# Altium project ESP12_RGBW_00.PrjPcb
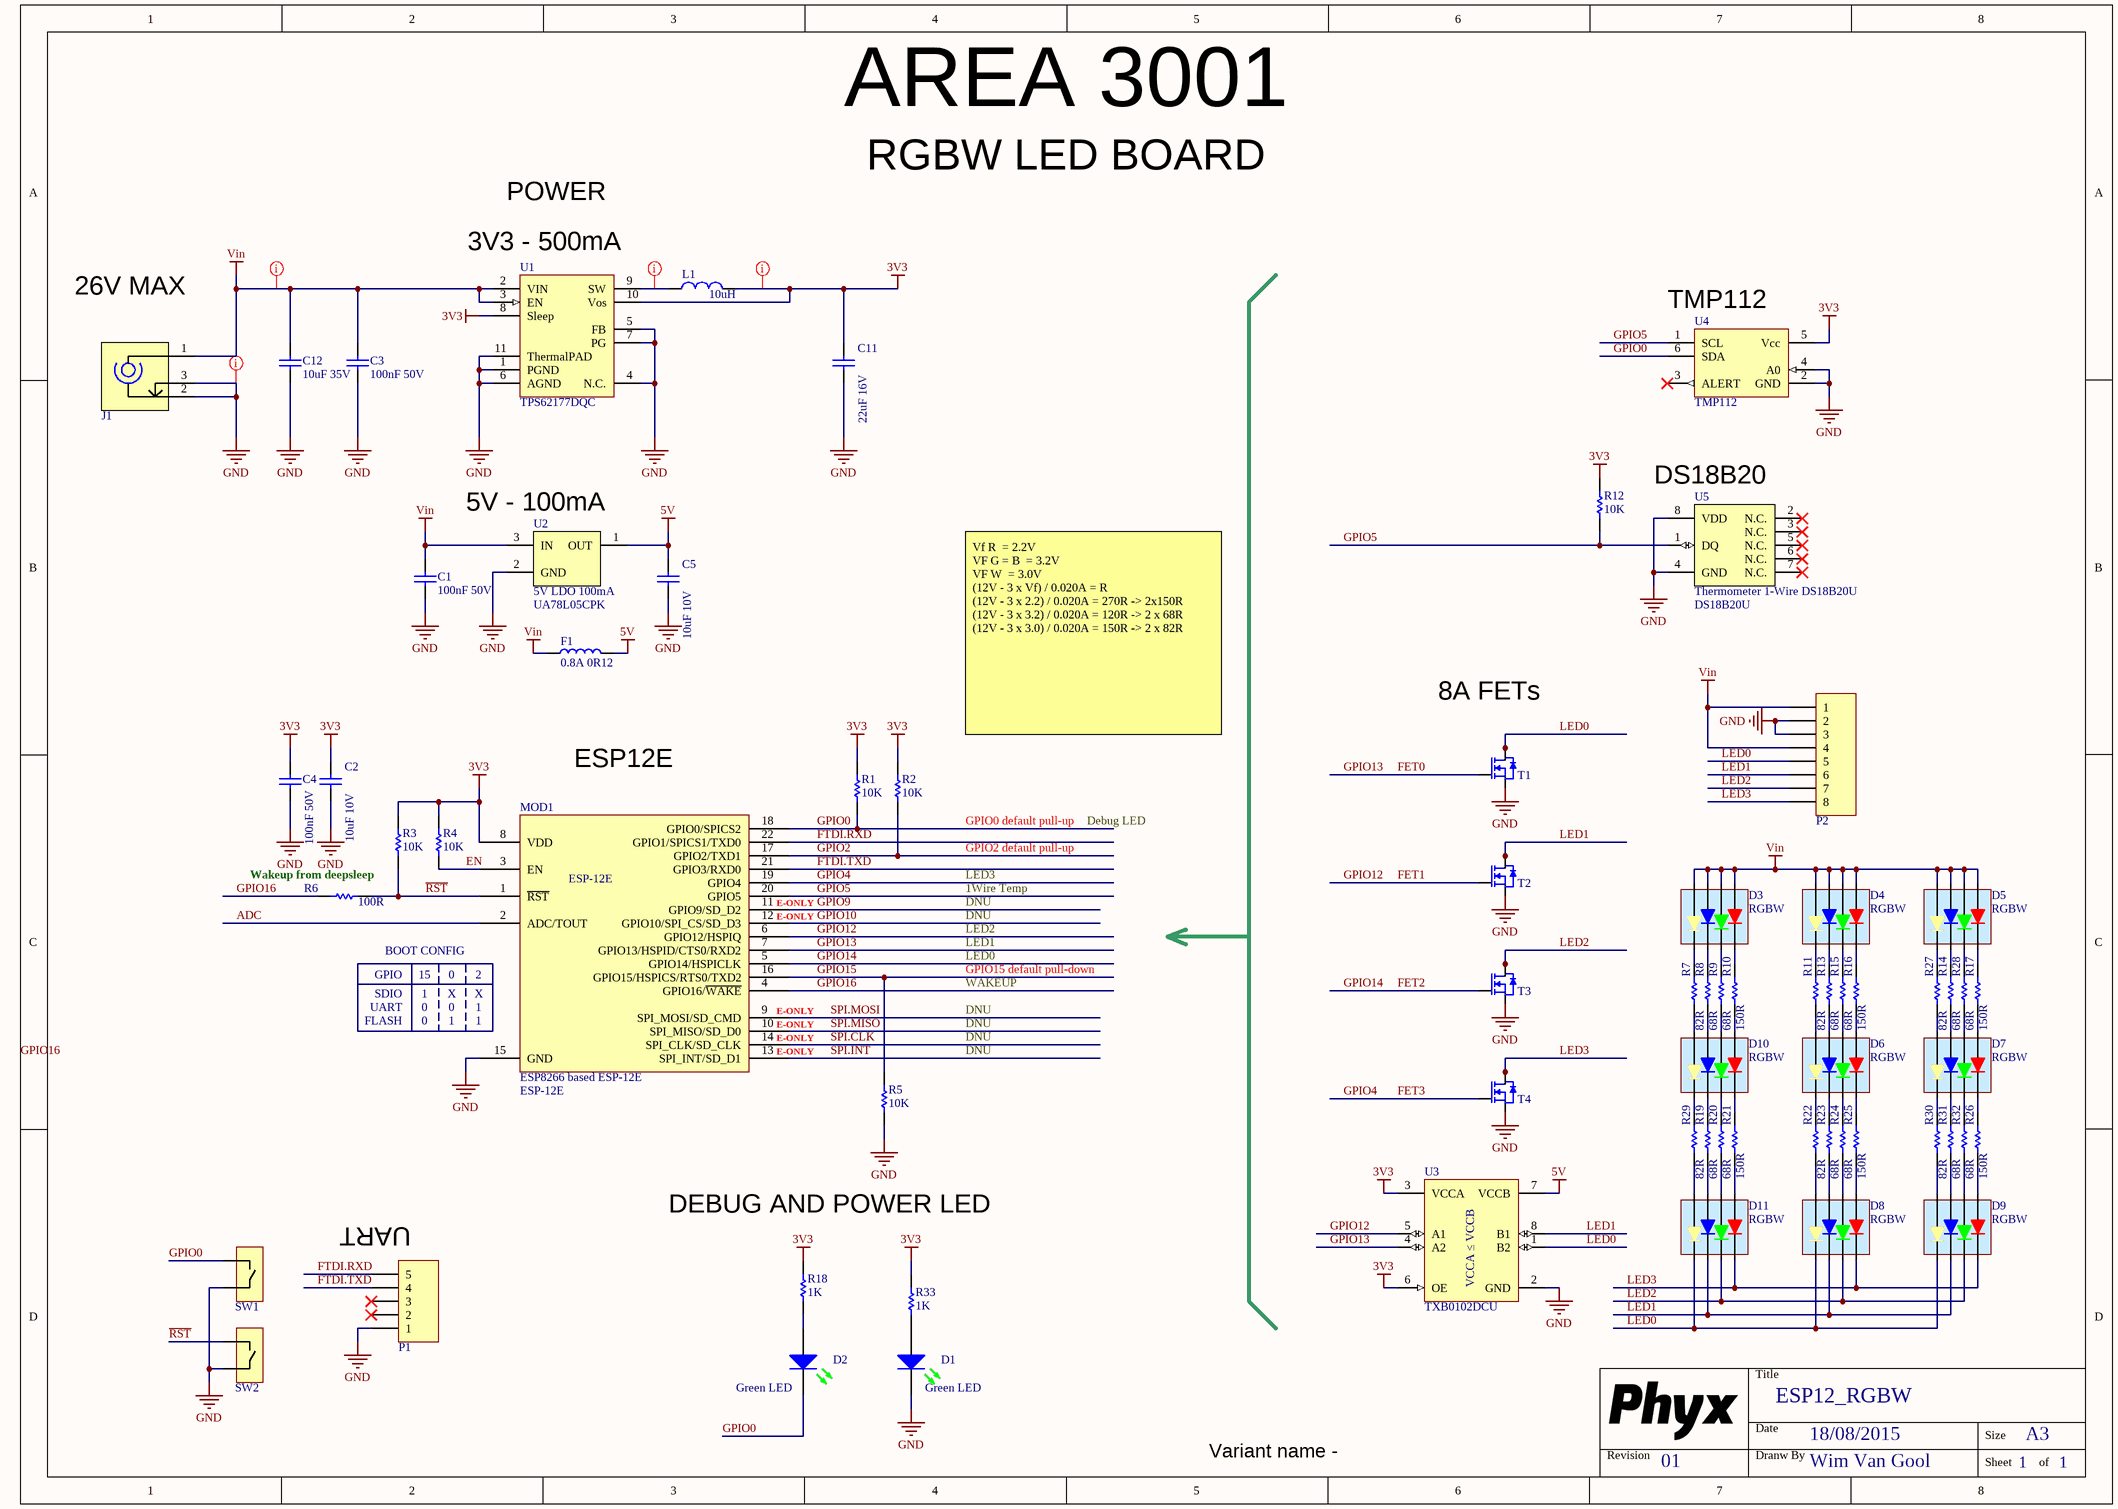
[diagram p0: ESP12_RGBW_00.SchDoc]
PCB_ENGINEER: WimVG; PCB_REV: 00; PCB_TITLE: ESP12_RGBW
1 sheet, 68 parts. Net scope: global (net labels, ports and power ports of the same name join across sheets).
Board file: ESP12_RGBW_00.PcbDoc

## Sheet ESP12_RGBW_00.SchDoc: ESP12_RGBW
size A3; Date: 18/08/2015; DrawnBy: Wim Van Gool; Revision: 01; SheetNumber: 1; SheetTotal: 1; PageSetup: Record=PageOptions|CenterHorizontal=True|CenterVertical=True|PrintScale=0.70|XCorrection=1.00|YCorrection=1.00|PrintKind=1|BorderSize=5000000|LeftOffset=0|BottomOffset=0|Orientation=2|PaperLength=1000|PaperWidth=1000|Scale=100|PaperSource=15|PrintQuality=600|MediaType=1|DitherType=10|PrintScaleMode=1|PaperKind=A4 (210 x 297 mm)|PaperIndex=9

### Parts
C1  value 100nF 50V  [C0603_N]  (hidden comment: CAP_CERAMIC)
C2  value 10uF 10V  [C1206_N]  (hidden comment: CAP_CERAMIC)
C3  value 100nF 50V  [C0603_N]  (hidden comment: CAP_CERAMIC)
C4  value 100nF 50V  [C0603_N]  (hidden comment: CAP_CERAMIC)
C5  value 10uF 10V  [C1206_N]  (hidden comment: CAP_CERAMIC)
C11  value 22uF 16V  [C1206_N]  (hidden comment: CAP_CERAMIC)
C12  value 10uF 35V  [C1206_N]  (hidden comment: CAP_CERAMIC)
D1  Green LED  [LED_0805_GR]
D2  Green LED  [LED_0805_GR]
D3  value RGBW  [LED_5050_RGBW_PLCC8]  (hidden comment: 5050 RGBW LED)
D4  value RGBW  [LED_5050_RGBW_PLCC8]  (hidden comment: 5050 RGBW LED)
D5  value RGBW  [LED_5050_RGBW_PLCC8]  (hidden comment: 5050 RGBW LED)
D6  value RGBW  [LED_5050_RGBW_PLCC8]  (hidden comment: 5050 RGBW LED)
D7  value RGBW  [LED_5050_RGBW_PLCC8]  (hidden comment: 5050 RGBW LED)
D8  value RGBW  [LED_5050_RGBW_PLCC8]  (hidden comment: 5050 RGBW LED)
D9  value RGBW  [LED_5050_RGBW_PLCC8]  (hidden comment: 5050 RGBW LED)
D10  value RGBW  [LED_5050_RGBW_PLCC8]  (hidden comment: 5050 RGBW LED)
D11  value RGBW  [LED_5050_RGBW_PLCC8]  (hidden comment: 5050 RGBW LED)
F1  value 0.8A 0R12  [L0805]  (hidden comment: FERRITE)
J1  Socket RA 4.75 with 1.75 barrel  [694105309102]  (value not drawn)
L1  value 10uH  [BRNS_SDR0503]  (hidden comment: SDR0503-100ML)
MOD1  ESP8266 based ESP-12E  value ESP-12E  [ESP-12E]
P1  Header 5  [HDR1X5]  (value not drawn)
P2  8 Terminal Socket RA 3,5mm  [WE_691322110008]  (value not drawn)
R1  value 10K  [R0603_N]  (hidden comment: RESISTOR)
R2  value 10K  [R0603_N]  (hidden comment: RESISTOR)
R3  value 10K  [R0603_N]  (hidden comment: RESISTOR)
R4  value 10K  [R0603_N]  (hidden comment: RESISTOR)
R5  value 10K  [R0603_N]  (hidden comment: RESISTOR)
R6  value 100R  [R0603_N]  (hidden comment: RESISTOR)
R7  value 82R  [R0603_N]  (hidden comment: RESISTOR)
R8  value 68R  [R0603_N]  (hidden comment: RESISTOR)
R9  value 68R  [R0603_N]  (hidden comment: RESISTOR)
R10  value 150R  [R0603_N]  (hidden comment: RESISTOR)
R11  value 82R  [R0603_N]  (hidden comment: RESISTOR)
R12  value 10K  [R0603_N]  (hidden comment: RESISTOR)
R13  value 68R  [R0603_N]  (hidden comment: RESISTOR)
R14  value 68R  [R0603_N]  (hidden comment: RESISTOR)
R15  value 68R  [R0603_N]  (hidden comment: RESISTOR)
R16  value 150R  [R0603_N]  (hidden comment: RESISTOR)
R17  value 150R  [R0603_N]  (hidden comment: RESISTOR)
R18  value 1K  [R0603_N]  (hidden comment: RESISTOR)
R19  value 68R  [R0603_N]  (hidden comment: RESISTOR)
R20  value 68R  [R0603_N]  (hidden comment: RESISTOR)
R21  value 150R  [R0603_N]  (hidden comment: RESISTOR)
R22  value 82R  [R0603_N]  (hidden comment: RESISTOR)
R23  value 68R  [R0603_N]  (hidden comment: RESISTOR)
R24  value 68R  [R0603_N]  (hidden comment: RESISTOR)
R25  value 150R  [R0603_N]  (hidden comment: RESISTOR)
R26  value 150R  [R0603_N]  (hidden comment: RESISTOR)
R27  value 82R  [R0603_N]  (hidden comment: RESISTOR)
R28  value 68R  [R0603_N]  (hidden comment: RESISTOR)
R29  value 82R  [R0603_N]  (hidden comment: RESISTOR)
R30  value 82R  [R0603_N]  (hidden comment: RESISTOR)
R31  value 68R  [R0603_N]  (hidden comment: RESISTOR)
R32  value 68R  [R0603_N]  (hidden comment: RESISTOR)
R33  value 1K  [R0603_N]  (hidden comment: RESISTOR)
SW1  LP SMD tact sw WS-TASV  [WE_434153017835]  (value not drawn)
SW2  LP SMD tact sw WS-TASV  [WE_434153017835]  (value not drawn)
T1  8A N-Ch MOSFET Vgs 1.9  [SOT23-6]  (value not drawn)
T2  8A N-Ch MOSFET Vgs 1.9  [SOT23-6]  (value not drawn)
T3  8A N-Ch MOSFET Vgs 1.9  [SOT23-6]  (value not drawn)
T4  8A N-Ch MOSFET Vgs 1.9  [SOT23-6]  (value not drawn)
U1  value TPS62177DQC  [TI_DQC_WSON10]  (hidden comment: Fixed 3.3V Buck 0.5A)
U2  5V LDO 100mA  value UA78L05CPK  [TI_PK]
U3  value TXB0102DCU  [TI_DCU_R-PDSO-G8]  (hidden comment: 2-bit Bi Level translator, 15kV ESD)
U4  value TMP112  [TI_DRL_R-PDSO-N6]  (hidden comment: I2C Temp sensor High Accuracy)
U5  Thermometer 1-Wire DS18B20U  value DS18B20U  [MAX_uSOP8]

### Nets
3V3: C2.1 C4.1 C11.1 L1.2 MOD1.8(VDD) R1.1 R2.1 R3.1 R4.1 R12.1 R18.1 R33.1 U1.8(Sleep) U1.10(Vos) U3.3(VCCA) U3.6(OE) U4.5(Vcc)
5V: C5.1 F1.2 U2.1(OUT) U3.7(VCCB)
GND: C1.2 C2.2 C3.2 C4.2 C5.2 C11.2 C12.2 D1.2(K) J1.2 J1.3 MOD1.15(GND) P1.1 P2.2 P2.3 R5.2 SW1.2 SW2.2 T1.4(S) T2.4(S) T3.4(S) T4.4(S) U1.1(PGND) U1.4(N.C.) U1.5(FB) U1.6(AGND) U1.7(PG) U1.11(ThermalPAD) U2.2(GND) U3.2(GND) U4.2(GND) U4.4(A0) U5.4(GND) U5.8(VDD)
Vin: C1.1 C3.1 C12.1 D3.1(RA) D3.3(GA) D3.5(BA) D3.7(WA) D4.1(RA) D4.3(GA) D4.5(BA) D4.7(WA) D5.1(RA) D5.3(GA) D5.5(BA) D5.7(WA) F1.1 J1.1 P2.1 P2.4 U1.2(VIN) U1.3(EN) U2.3(IN)
ADC: MOD1.2(ADC/TOUT)
EN: MOD1.3(EN) R4.2
FET0: MOD1.7(GPIO13/HSPID/CTS0/RXD2) T1.3(G) U3.4(A2)  [also labelled GPIO13]
FET1: MOD1.6(GPIO12/HSPIQ) T2.3(G) U3.5(A1)  [also labelled GPIO12]
FET2: MOD1.5(GPIO14/HSPICLK) T3.3(G)  [also labelled GPIO14]
FET3: MOD1.19(GPIO4) T4.3(G)  [also labelled GPIO4]
FTDI.RXD: MOD1.22(GPIO1/SPICS1/TXD0) P1.5
FTDI.TXD: MOD1.21(GPIO3/RXD0) P1.4
GPIO0: D2.2(K) MOD1.18(GPIO0/SPICS2) R1.2 SW1.1 U4.6(SDA)
GPIO2: MOD1.17(GPIO2/TXD1) R2.2
GPIO5: MOD1.20(GPIO5) R12.2 U4.1(SCL) U5.1(DQ)
GPIO9: MOD1.11(GPIO9/SD_D2)
GPIO10: MOD1.12(GPIO10/SPI_CS/SD_D3)
GPIO15: MOD1.16(GPIO15/HSPICS/RTS0/TXD2) R5.1
GPIO16: MOD1.4(GPIO16/~{WAKE}) R6.2
LED0: D8.8(WC) D9.8(WC) D11.8(WC) P2.5 T1.1(D) T1.2(D) T1.5(D) T1.6(D) U3.1(B2)
LED1: D8.6(BC) D9.6(BC) D11.6(BC) P2.6 T2.1(D) T2.2(D) T2.5(D) T2.6(D) U3.8(B1)
LED2: D8.4(GC) D9.4(GC) D11.4(GC) P2.7 T3.1(D) T3.2(D) T3.5(D) T3.6(D)
LED3: D8.2(RC) D9.2(RC) D11.2(RC) P2.8 T4.1(D) T4.2(D) T4.5(D) T4.6(D)
~{RST}: MOD1.1(~{RST}) R3.2 R6.1 SW2.1
SPI.CLK: MOD1.14(SPI_CLK/SD_CLK)
SPI.INT: MOD1.13(SPI_INT/SD_D1)
SPI.MISO: MOD1.10(SPI_MISO/SD_D0)
SPI.MOSI: MOD1.9(SPI_MOSI/SD_CMD)
NetD1_1: D1.1(A) R33.2
NetD2_1: D2.1(A) R18.2
NetD3_2: D3.2(RC) R10.1
NetD3_4: D3.4(GC) R9.1
NetD3_6: D3.6(BC) R8.1
NetD3_8: D3.8(WC) R7.1
NetD4_2: D4.2(RC) R16.1
NetD4_4: D4.4(GC) R15.1
NetD4_6: D4.6(BC) R13.1
NetD4_8: D4.8(WC) R11.1
NetD5_2: D5.2(RC) R17.1
NetD5_4: D5.4(GC) R28.1
NetD5_6: D5.6(BC) R14.1
NetD5_8: D5.8(WC) R27.1
NetD6_1: D6.1(RA) R16.2
NetD6_2: D6.2(RC) R25.1
NetD6_3: D6.3(GA) R15.2
NetD6_4: D6.4(GC) R24.1
NetD6_5: D6.5(BA) R13.2
NetD6_6: D6.6(BC) R23.1
NetD6_7: D6.7(WA) R11.2
NetD6_8: D6.8(WC) R22.1
NetD7_1: D7.1(RA) R17.2
NetD7_2: D7.2(RC) R26.1
NetD7_3: D7.3(GA) R28.2
NetD7_4: D7.4(GC) R32.1
NetD7_5: D7.5(BA) R14.2
NetD7_6: D7.6(BC) R31.1
NetD7_7: D7.7(WA) R27.2
NetD7_8: D7.8(WC) R30.1
NetD8_1: D8.1(RA) R25.2
NetD8_3: D8.3(GA) R24.2
NetD8_5: D8.5(BA) R23.2
NetD8_7: D8.7(WA) R22.2
NetD9_1: D9.1(RA) R26.2
NetD9_3: D9.3(GA) R32.2
NetD9_5: D9.5(BA) R31.2
NetD9_7: D9.7(WA) R30.2
NetD10_1: D10.1(RA) R10.2
NetD10_2: D10.2(RC) R21.1
NetD10_3: D10.3(GA) R9.2
NetD10_4: D10.4(GC) R20.1
NetD10_5: D10.5(BA) R8.2
NetD10_6: D10.6(BC) R19.1
NetD10_7: D10.7(WA) R7.2
NetD10_8: D10.8(WC) R29.1
NetD11_1: D11.1(RA) R21.2
NetD11_3: D11.3(GA) R20.2
NetD11_5: D11.5(BA) R19.2
NetD11_7: D11.7(WA) R29.2
NetL1_1: L1.1 U1.9(SW)

Not connected (* = marked no-connect by the designer): P1 2* 3*; U4 3(ALERT)*; U5 2(N.C.)* 3(N.C.)* 5(N.C.)* 6(N.C.)* 7(N.C.)*

### Layout directives
net class POWER: 3V3, GND, NetL1_1, Vin

### Notes on the sheet
- AREA 3001
- RGBW LED BOARD
- POWER
- 26V MAX
- (near U1) 3V3 - 500mA
- (near U4) TMP112
- (near U2) 5V - 100mA
- (near U5) DS18B20
- (near T1) 8A FETs
- ESP12E
- Vf R 	= 2.2V
  VF G = B 	= 3.2V
  VF W 	= 3.0V
  (12V - 3 x Vf) / 0.020A = R
  (12V - 3 x 2.2) / 0.020A = 270R -> 2x150R
  (12V - 3 x 3.2) / 0.020A = 120R -> 2 x 68R
  (12V - 3 x 3.0) / 0.020A = 150R -> 2 x 82R
- GPIO0 default pull-up
- GPIO2 default pull-up
- Debug LED
- (near R6) Wakeup from deepsleep
- (near MOD1) E-ONLY
- DNU
- 1Wire Temp
- LED3
- GPIO
- SDIO
- 15
- 1
- BOOT CONFIG
- 0
- X
- (near MOD1) 2
- (near MOD1) X
- GPIO15 default pull-down
- WAKEUP
- LED0
- LED1
- LED2
- UART
- FLASH
- (near MOD1) 1
- (near P1) UART
- DEBUG AND POWER LED
- Title
- Variant name -
- Revision
- Date
- Dranw By
- Size
- A3
- Sheet
- of
- Labels drawn without touching a wire or pin: GPIO16
- (in symbol LVL # 2ch TXB0102DCU) VCCA ≤ VCCB

### Library data of the parts
C1 C3 C4 = CAP # 100nF 50V 0603: Capacitor Ceramic; Supplier 1: Farnell; Supplier Part Number 1: 1759122
C2 C5 = CAP # 10uF 10V 0805: Capacitor Ceramic; Supplier 1: Farnell; Supplier Part Number 1: 2320859
C11 = CAP # 22uF 16V 1206 X5R: Capacitor Ceramic; Supplier 1: Farnell; Supplier Part Number 1: 2320923
C12 = CAP # 10uF 35V 1206 X5R: Capacitor Ceramic; Supplier 1: Farnell; Supplier Part Number 1: 1797011
D1 D2 = LED # Green 0805: =Description; Supplier 1: Farnell; Supplier Part Number 1: 2099239
D3-D11 = LED # RGBW 5050: =Description; Supplier 1: Aliexpress
F1 = FER # 120R 0.8A 0805 0R12: Supplier 1: Farnell; Supplier Part Number 1: 1669728
J1 = SCKT 1.75mm barrel in board - 694105309102: Socket RA 5.5  with 2.1 barrel; Value: 694105309102; Supplier 1: Farnell
L1 = IND # 10uH 5x4.8mm SDR0503-100ML: Supplier 1: Farnell; Supplier Part Number 1: 1612675
MOD1 = WiFi # MOD ESP-12E: =Description
P1 = Pin Header 2.54mm 5way: Description: Pin Header 2.54mm 5way
P2 = Terminal Block Socket RA 3,5mm 8way - 691322110008: Value: 691322110008
R1-R5 R12 = RES # 10K 0603
R6 = RES # 100R 0603
R7 R11 R22 R27 R29 R30 = RES # 82R 0603: Description: RES # 82R 0603
R8 R9 R13-R15 R19 R20 R23 R24 R28 R31 R32 = RES # 68R 0603
R10 R16 R17 R21 R25 R26 = RES # 150R 0603: Description: RES # 150R 0603
R18 R33 = RES # 1K 0603
SW1 SW2 = SW # TACT mini 3.5x2.9 mm SMD J-Bend WS-TASV: Value: 434153017835; Description: SW # TACT mini 3.5x2.9 mm SMD J-Bend WS-TASV
T1-T4 = SQ3456EV-T1-GE3 N-Ch MOSFET 8A 1.9Vgs 30Vds: Value: SQ3456EV-T1-GE3; Supplier 1: Farnell; Supplier Part Number 1: 2322581
U1 = PWR # Buck TPS62177 3.3V 0.5A: =Description; Supplier 1: Farnell; Supplier Part Number 1: 2255014
U2 = LDO # 5V 100mA: LDO 5V 100mA; Supplier 1: Farnell; Supplier Part Number 1: 2112604
U3 = LVL # 2ch TXB0102DCU: =Description; Supplier 1: Farnell
U4 = TEMP # TMP112: =Description; Supplier 1: Farnell; Supplier Part Number 1: 1735574
U5 = TMP # DS18B20U: =Description; Supplier 1: Farnell; Supplier Part Number 1: 1379725

## Assembly variants
Internal: not fitted C1 C5 D1 F1 P2 R6 R33 U2 U3 U5
External RGBW: not fitted C1 C5 D3 D4 D5 D6 D7 D8 D9 D10 D11 F1 J1 R6 R7 R8 R9 R10 R11 R13 R14 R15 R16 R17 R19 R20 R21 R22 R23 R24 R25 R26 R27 R28 R29 R30 R31 R32 U2 U3 U5
External Digital: not fitted D3 D4 D5 D6 D7 D8 D9 D10 D11 F1 J1 R6 R7 R8 R9 R10 R11 R13 R14 R15 R16 R17 R19 R20 R21 R22 R23 R24 R25 R26 R27 R28 R29 R30 R31 R32 T1 T2 U5